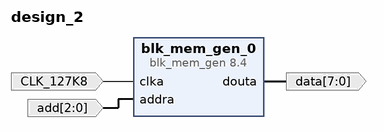
[diagram p0: block diagram of the top level]
# Vivado block design design_2, xc7a100tfgg484-2, Vivado 2018.3
create_bd_design design_2

create_bd_port -dir I -type clk CLK_127K8
set_property -dict {CONFIG.FREQ_HZ 127874} [get_bd_ports CLK_127K8]
create_bd_port -dir I -from 2 -to 0 add
create_bd_port -dir O -from 7 -to 0 -type data data

create_bd_cell -type ip -vlnv xilinx.com:ip:blk_mem_gen:8.4 blk_mem_gen_0
set_property -dict [list \
  CONFIG.Coe_File ../../../../../../design_2_blk_mem_gen_0_0.coe \
  CONFIG.Enable_32bit_Address false \
  CONFIG.Enable_A Use_ENA_Pin \
  CONFIG.Load_Init_File true \
  CONFIG.Memory_Type Single_Port_ROM \
  CONFIG.Port_A_Write_Rate 0 \
  CONFIG.Port_B_Clock 0 \
  CONFIG.Port_B_Enable_Rate 0 \
  CONFIG.Register_PortA_Output_of_Memory_Core false \
  CONFIG.Register_PortA_Output_of_Memory_Primitives true \
  CONFIG.Use_RSTA_Pin false \
  CONFIG.Write_Depth_A 8 \
  CONFIG.Write_Width_A 32 \
  CONFIG.use_bram_block Stand_Alone \
] [get_bd_cells blk_mem_gen_0]

# ---- connections ----

connect_bd_net -net CLK_127K8_1 [get_bd_ports CLK_127K8] [get_bd_pins blk_mem_gen_0/clka]
connect_bd_net [get_bd_ports add] [get_bd_pins blk_mem_gen_0/addra]
connect_bd_net [get_bd_pins blk_mem_gen_0/douta] [get_bd_ports data]

validate_bd_design
save_bd_design
